# EAGLE schematic merkez (EAGLE 9.6.2)
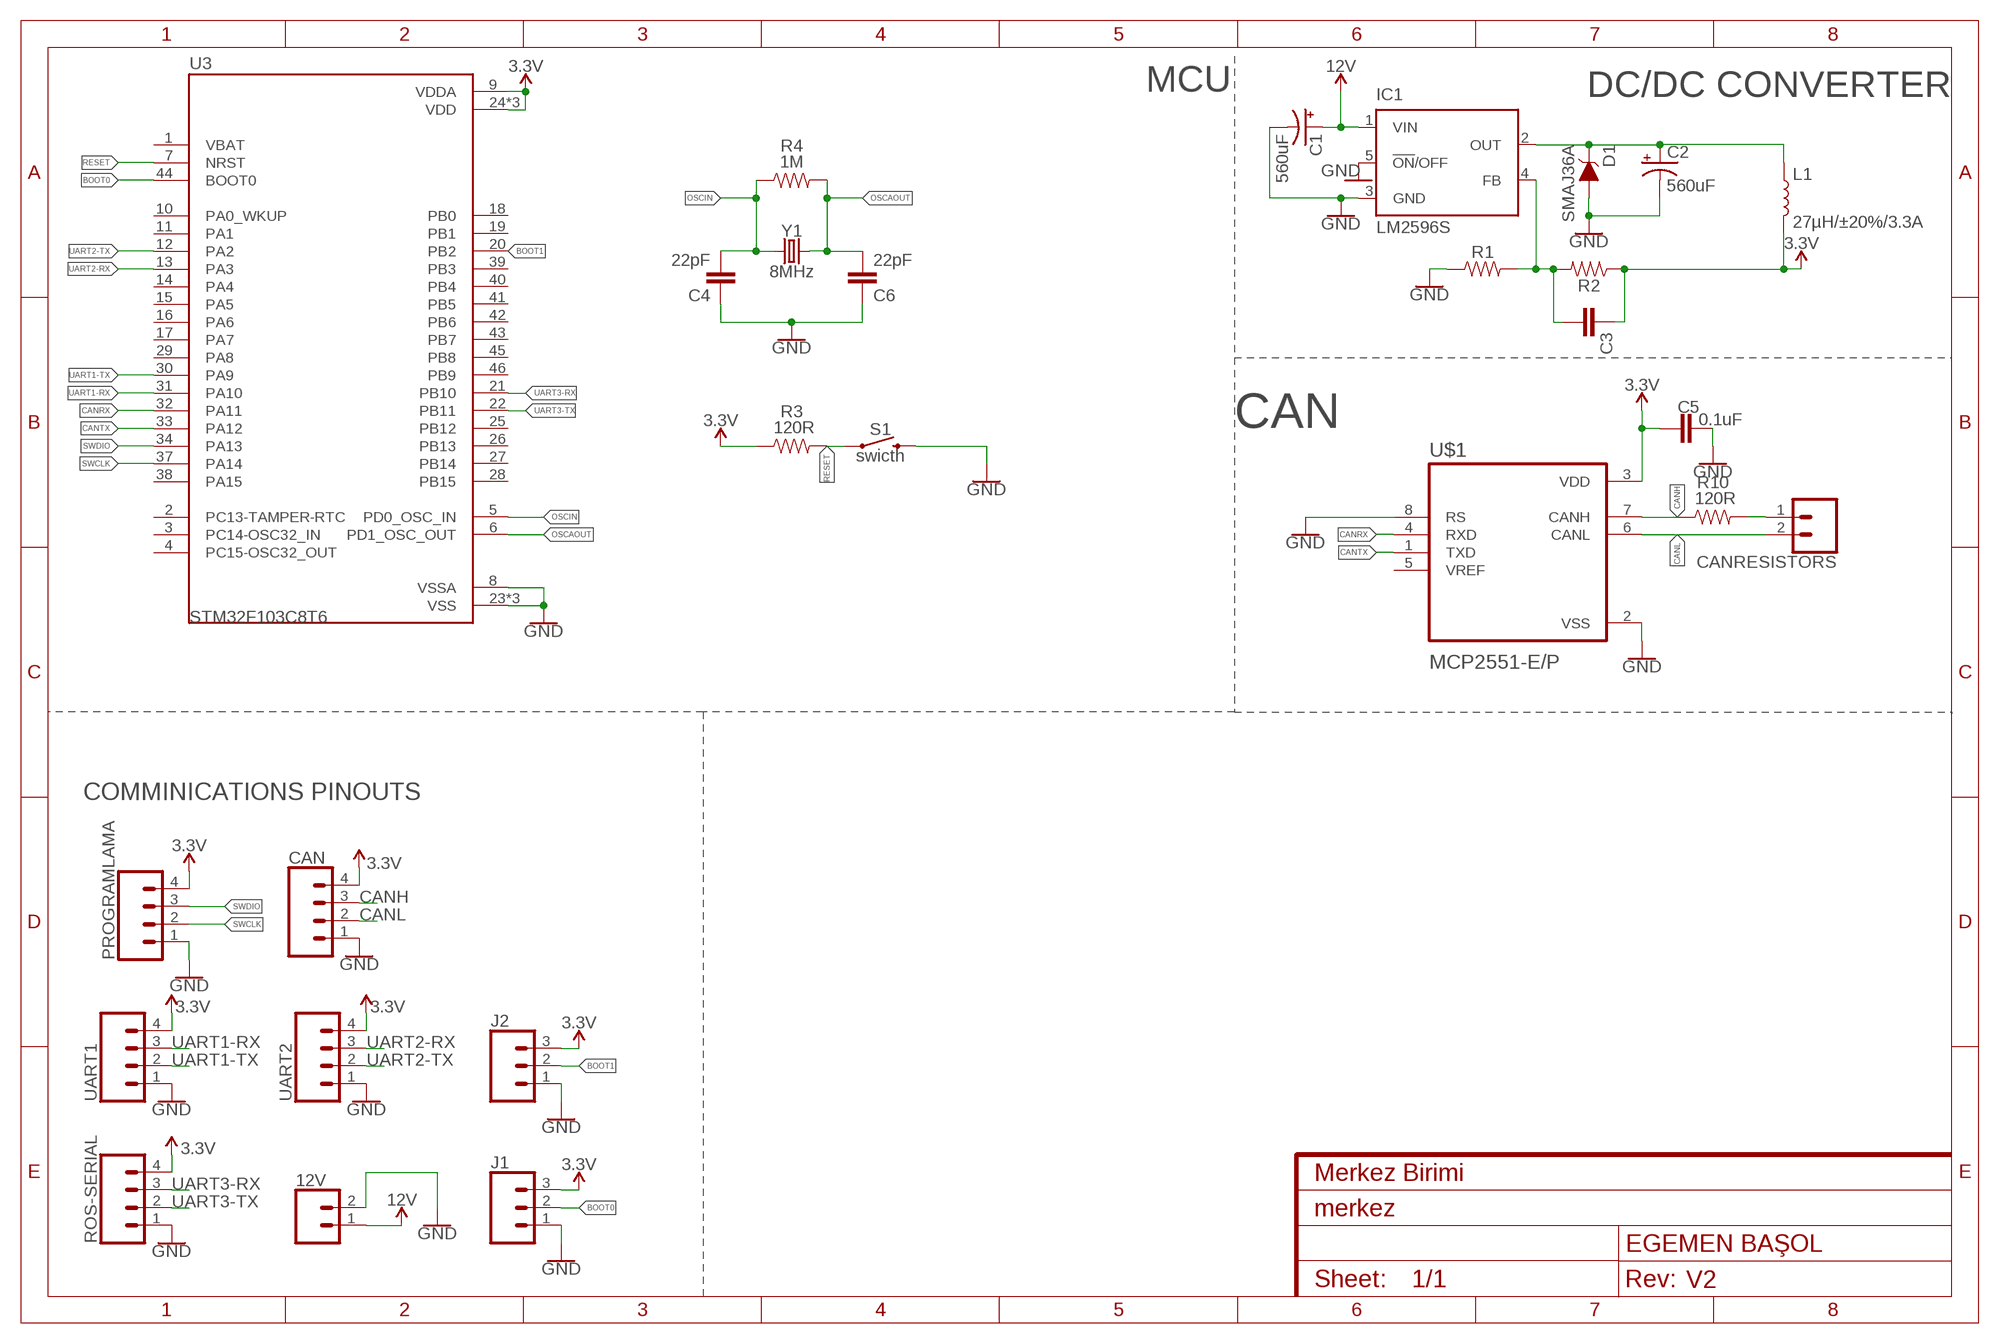
[diagram p0: schematic, sheet 1]
FRAME1 (FRAME-A4L): CNAME: Merkez Birimi; CREVISION: V2; DESIGNER: EGEMEN BAŞOL

## Parts
12V  CONN_023.5MM_LOCK  [SCREWTERMINAL-3.5MM-2_LOCK]
C1  560uF  560UF-PANASONIC_G-25V-20%  [PANASONIC_G]
C2  560uF  560UF-PANASONIC_G-25V-20%  [PANASONIC_G]
C3  CAP-0805  [0805]
C4  22pF  CAP-0805  [0805]
C5  0.1uF  CAP-0805  [0805]
C6  22pF  CAP-0805  [0805]
CAN  CONN_04SCREW_LOCK  [SCREWTERMINAL-3.5MM-4_LOCK]
CANRESISTORS  CONN_02LOCK_LONGPADS  [1X02_LOCK_LONGPADS]
D1  SMAJ36A  DIODE_TVS_UNI  [DO-214AC]
IC1  LM2596S  [TO263-5]
J1  455-1750-1-ND  CONN_03  [1X03]
J2  455-1750-1-ND  CONN_03  [1X03]
L1  27µH/±20%/3.3A  INDUCTOR-SDR13-27UH  [INDUCTOR_SDR1307]
PROGRAMLAMA  CONN_04SCREW_LOCK  [SCREWTERMINAL-3.5MM-4_LOCK]
R1  RESISTOR0805  [0805]
R2  RESISTOR0805  [0805]
R3  120R  RESISTOR0805  [0805]
R4  1M  RESISTOR0805  [0805]
R10  120R  RESISTOR0805  [0805]
ROS-SERIAL  CONN_04SCREW_LOCK  [SCREWTERMINAL-3.5MM-4_LOCK]
S1  swicth  MOMENTARY-SWITCH-SPST-SMD-5.2MM-TALL  [TACTILE_SWITCH_SMD_5.2MM]
U3  STM32F103C8T6  [QFP50P900X900X160-48N]
U$1  MCP2551-E/P  [DIP787W46P254L927H533Q8]
UART1  CONN_04SCREW_LOCK  [SCREWTERMINAL-3.5MM-4_LOCK]
UART2  CONN_04SCREW_LOCK  [SCREWTERMINAL-3.5MM-4_LOCK]
Y1  8MHz  CRYSTAL-8MHZSMD-HC49UP  [HC49UP]

## Nets
3.3V: C3.1 C5.2 CAN.4 J1.3 J2.3 L1.P$2 PROGRAMLAMA.4 R2.1 R3.1 ROS-SERIAL.4 U3.9(VDDA) U3.24(VDD) U3.36(VDD) U3.48(VDD) U$1.3(VDD) UART1.4 UART2.4
12V: 12V.1 C1.+ IC1.1(VIN)
BOOT0: J1.2 U3.44(BOOT0)
BOOT1: J2.2
CANH: CAN.3 R10.1 U$1.7(CANH)
CANL: CAN.2 CANRESISTORS.2 U$1.6(CANL)
CANRX: U3.32(PA11) U$1.4(RXD)
CANTX: U3.33(PA12) U$1.1(TXD)
GND: 12V.2 C1.- C2.- C4.1 C5.1 C6.1 CAN.1 D1.A IC1.3(GND) IC1.5(!ON!/OFF) J1.1 J2.1 PROGRAMLAMA.1 R1.1 ROS-SERIAL.1 S1.3 U3.8(VSSA) U3.23(VSS) U3.35(VSS) U3.47(VSS) U$1.2(VSS) U$1.8(RS) UART1.1 UART2.1
N$1: C2.+ D1.C IC1.2(OUT) L1.P$1
N$2: C3.2 IC1.4(FB) R1.2 R2.2
N$5: CANRESISTORS.1 R10.2
OSCAOUT: C6.2 R4.2 U3.6(PD1_OSC_OUT) Y1.2
OSCIN: C4.2 R4.1 U3.5(PD0_OSC_IN) Y1.1
RESET: R3.2 S1.1 U3.7(NRST)
SWCLK: PROGRAMLAMA.2 U3.37(PA14)
SWDIO: PROGRAMLAMA.3 U3.34(PA13)
UART1-RX: U3.31(PA10) UART1.3
UART1-TX: U3.30(PA9) UART1.2
UART2-RX: U3.13(PA3) UART2.3
UART2-TX: U3.12(PA2) UART2.2
UART3-RX: ROS-SERIAL.3 U3.21(PB10)
UART3-TX: ROS-SERIAL.2 U3.22(PB11)
Unconnected: U3.1(VBAT) U3.2(PC13-TAMPER-RTC) U3.3(PC14-OSC32_IN) U3.4(PC15-OSC32_OUT) U3.10(PA0_WKUP) U3.11(PA1) U3.14(PA4) U3.15(PA5) U3.16(PA6) U3.17(PA7) U3.18(PB0) U3.19(PB1) U3.20(PB2) U3.25(PB12) U3.26(PB13) U3.27(PB14) U3.28(PB15) U3.29(PA8) U3.38(PA15) U3.39(PB3) U3.40(PB4) U3.41(PB5) U3.42(PB6) U3.43(PB7) U3.45(PB8) U3.46(PB9) U$1.5(VREF)

## Notes on the sheet
- MCU | DC/DC CONVERTER
- CAN
- COMMINICATIONS PINOUTS

## Library data of the parts
12V = SparkFun-Connectors:CONN_02: Multi connection point. Often used as Generic Header-pin footprint for 0.1 inch spaced/style header connections On any of the 0.1 inch spaced packages, you can populate with these: Break Away Headers - Straight <https://www.sparkfun.com/products/116> (PRT-00116) Break Away Male Headers - Right Angle <https://www.sparkfun.com/products/553> (PRT-00553) Female Headers <https://www.sparkfun.com/products/115> (PRT-00115) Break Away Headers - Machine Pin <https://www.sparkfun.com/products/117> (PRT-00117) Break Away Female Headers - Swiss Machine Pin <https://www.sparkfun.com/products/743> (PRT-00743) For SCREWTERMINALS and SPRING TERMINALS visit here: Screw Terimnals on SparkFun.com <https://www.sparkfun.com/search/results?term=Screw+Terminals> (5mm/3.5mm/2.54mm spacing) This device is also useful as a general connection point to wire up your design to another part of your project. Our various solder wires solder well into these plated through hole pads. Hook-Up Wire - Assortment (Stranded, 22 AWG) <https://www.sparkfun.com/products/11375> (PRT-11375) Hook-Up Wire - Assortment (Solid Core, 22 AWG) <https://www.sparkfun.com/products/11367> (PRT-11367) View the entire wire category on our website here <https://www.sparkfun.com/categories/141> Special notes: Molex polarized connector foot print use with: PRT-08233 with associated crimp pins and housings. 2.54_SCREWTERM for use with PRT-10571. 3.5mm Screw Terminal footprints for PRT-08084 5mm Screw Terminal footprints for use with PRT-08432; PROD_ID: CONN-08399
C1 C2 = SparkFun-Capacitors:560UF: 560µF polarized capacitors A capacitor is a passive two-terminal electrical component used to store electrical energy temporarily in an electric field.; PROD_ID: CAP-09983
C3-C6 = SparkFun-Capacitors:CAP
CAN PROGRAMLAMA ROS-SERIAL UART1 UART2 = SparkFun-Connectors:CONN_04: Multi connection point. Often used as Generic Header-pin footprint for 0.1 inch spaced/style header connections On any of the 0.1 inch spaced packages, you can populate with these: Break Away Headers - Straight <https://www.sparkfun.com/products/116> (PRT-00116) Break Away Male Headers - Right Angle <https://www.sparkfun.com/products/553> (PRT-00553) Female Headers <https://www.sparkfun.com/products/115> (PRT-00115) Break Away Headers - Machine Pin <https://www.sparkfun.com/products/117> (PRT-00117) Break Away Female Headers - Swiss Machine Pin <https://www.sparkfun.com/products/743> (PRT-00743) For SCREWTERMINALS and SPRING TERMINALS visit here: Screw Terimnals on SparkFun.com <https://www.sparkfun.com/search/results?term=Screw+Terminals> (5mm/3.5mm/2.54mm spacing) This device is also useful as a general connection point to wire up your design to another part of your project. Our various solder wires solder well into these plated through hole pads. Hook-Up Wire - Assortment (Stranded, 22 AWG) <https://www.sparkfun.com/products/11375> (PRT-11375) Hook-Up Wire - Assortment (Solid Core, 22 AWG) <https://www.sparkfun.com/products/11367> (PRT-11367) View the entire wire category on our website here <https://www.sparkfun.com/categories/141> Special notes: Molex polarized connector foot print use with SKU : PRT-08231 with associated crimp pins and housings. 1MM SMD Version SKU: PRT-10208
CANRESISTORS = SparkFun-Connectors:CONN_02: Multi connection point. Often used as Generic Header-pin footprint for 0.1 inch spaced/style header connections On any of the 0.1 inch spaced packages, you can populate with these: Break Away Headers - Straight <https://www.sparkfun.com/products/116> (PRT-00116) Break Away Male Headers - Right Angle <https://www.sparkfun.com/products/553> (PRT-00553) Female Headers <https://www.sparkfun.com/products/115> (PRT-00115) Break Away Headers - Machine Pin <https://www.sparkfun.com/products/117> (PRT-00117) Break Away Female Headers - Swiss Machine Pin <https://www.sparkfun.com/products/743> (PRT-00743) For SCREWTERMINALS and SPRING TERMINALS visit here: Screw Terimnals on SparkFun.com <https://www.sparkfun.com/search/results?term=Screw+Terminals> (5mm/3.5mm/2.54mm spacing) This device is also useful as a general connection point to wire up your design to another part of your project. Our various solder wires solder well into these plated through hole pads. Hook-Up Wire - Assortment (Stranded, 22 AWG) <https://www.sparkfun.com/products/11375> (PRT-11375) Hook-Up Wire - Assortment (Solid Core, 22 AWG) <https://www.sparkfun.com/products/11367> (PRT-11367) View the entire wire category on our website here <https://www.sparkfun.com/categories/141> Special notes: Molex polarized connector foot print use with: PRT-08233 with associated crimp pins and housings. 2.54_SCREWTERM for use with PRT-10571. 3.5mm Screw Terminal footprints for PRT-08084 5mm Screw Terminal footprints for use with PRT-08432
D1 = SparkFun-DiscreteSemi:DIODE_TVS_UNI; PROD_ID: DIO-15812
IC1 = national-semiconductor:LM2596: SIMPLE SWITCHER® Power Converter 150 kHz 3A Step-Down Voltage Regulator Source: http://www.national.com/ds/LM/LM2596.pdf; MF: NATIONAL SEMICONDUCTOR; MPN: LM2596S-ADJ/NOPB; OC_FARNELL: 9494367; OC_NEWARK: 41K3842
J1 J2 = SparkFun-Connectors:CONN_03: Multi connection point. Often used as Generic Header-pin footprint for 0.1 inch spaced/style header connections On any of the 0.1 inch spaced packages, you can populate with these: Break Away Headers - Straight <https://www.sparkfun.com/products/116> (PRT-00116) Break Away Male Headers - Right Angle <https://www.sparkfun.com/products/553> (PRT-00553) Female Headers <https://www.sparkfun.com/products/115> (PRT-00115) Break Away Headers - Machine Pin <https://www.sparkfun.com/products/117> (PRT-00117) Break Away Female Headers - Swiss Machine Pin <https://www.sparkfun.com/products/743> (PRT-00743) Stackable Header - 3 Pin (Female, 0.1") <https://www.sparkfun.com/products/13875> (PRT-13875) For SCREWTERMINALS and SPRING TERMINALS visit here: Screw Terimnals on SparkFun.com <https://www.sparkfun.com/search/results?term=Screw+Terminals> (5mm/3.5mm/2.54mm spacing) This device is also useful as a general connection point to wire up your design to another part of your project. Our various solder wires solder well into these plated through hole pads. Hook-Up Wire - Assortment (Stranded, 22 AWG) <https://www.sparkfun.com/products/11375> (PRT-11375) Hook-Up Wire - Assortment (Solid Core, 22 AWG) <https://www.sparkfun.com/products/11367> (PRT-11367) View the entire wire category on our website here <https://www.sparkfun.com/categories/141> Special notes: Molex polarized connector foot print use with SKU : PRT-08232 with associated crimp pins and housings.; PROD_ID: XXX-00000
L1 = SparkFun-Coils:INDUCTOR: Inductors Resist changes in electrical current. Basically a coil of wire. SparkFun Products: SparkFun Load Cell Amplifier - HX711 <https://www.sparkfun.com/products/13879> IOIO-OTG - V2.2 <https://www.sparkfun.com/products/13613>; PROD_ID: NDUC-12529
R1-R4 R10 = SparkFun-Resistors:RESISTOR: Generic Resistor Package
S1 = SparkFun-Switches:MOMENTARY-SWITCH-SPST: Momentary Switch (Pushbutton) - SPST Normally-open (NO) SPST momentary switches (buttons, pushbuttons). Variants PTH-12MM - 12mm square, through-hole Momentary Pushbutton Switch - 12mm Square <https://www.sparkfun.com/products/9190> (COM-09190) PTH-6.0MM, PTH-6.0MM-KIT - 6.0mm square, through-hole Mini Pushbutton Switch <https://www.sparkfun.com/products/97> (COM-00097) KIT package intended for soldering kit's - only one side of pads' copper is exposed. PTH-RIGHT-ANGLE-KIT - Right-angle, through-hole Right Angle Tactile Button <https://www.sparkfun.com/products/10791> - Used on SparkFun BigTime Watch Kit <https://www.sparkfun.com/products/11734> SMD-12MM - 12mm square, surface-mount Tactile Button - SMD (12mm) <https://www.sparkfun.com/products/12993> (COM-12993) Used on SparkFun PicoBoard <https://www.sparkfun.com/products/11888> SMD-4.5MM - 4.5mm Square Trackball Switch Used on SparkFun Blackberry Trackballer Breakout <https://www.sparkfun.com/products/13169> SMD-4.6MMX2.8MM - 4.60mm x 2.80mm, surface mount Used on SparkFun Pro Micro - RP2040 <https://www.sparkfun.com/products/17717> SMD-5.2MM, SMD-5.2-REDUNDANT - 5.2mm square, surface-mount Mini Pushbutton Switch - SMD <https://www.sparkfun.com/products/8720> (COM-08720) Used on Arduino Pro Mini <https://www.sparkfun.com/products/11114> REDUNDANT package connects both switch circuits together SMD-6.0X3.5MM - 6.0 x 3.5mm, surface mount Momentary Reset Switch SMD <https://www.sparkfun.com/products/8229> (COM-08229) SMD-6.2MM-TALL - 6.2mm square, surface mount Tactile Button - SMD (6mm) <https://www.sparkfun.com/products/12992> Used on SparkFun Digital Sandbox <https://www.sparkfun.com/products/12651> SMD-RIGHT-ANGLE - Right-angle, surface mount Used on SparkFun Block for Intel® Edison - Arduino <https://www.sparkfun.com/products/13036>; PROD_ID: SWCH-14139
U3 = STM32F103C8T6:STM32F103C8T6: Mainstream Performance line, ARM Cortex-M3 MCU with 64 Kbytes Flash, 72 MHz CPU, motor control, USB and CAN Check availability <https://pricing.snapeda.com/parts/STM32F103C8T6/STMicroelectronics/view-part?ref=eda>; AVAILABILITY: In Stock; DESCRIPTION: ARM® Cortex®-M3 STM32F1 Microcontroller IC 32-Bit 72MHz 64KB (64K x 8) FLASH 48-LQFP (7x7); MF: STMicroelectronics; MP: STM32F103C8T6; PACKAGE: LQFP-48 STMicroelectronics; PRICE: None; PURCHASE-URL: https://pricing.snapeda.com/search/part/STM32F103C8T6/?ref=eda
U$1 = MCP2551-E_P:MCP2551-E/P: Check availability <https://pricing.snapeda.com/parts/MCP2551-E/P/Microchip/view-part?ref=eda>; AVAILABILITY: In Stock; DESCRIPTION: 1/1 Transceiver Half CANbus 8-PDIP; MF: Microchip; MP: MCP2551-E/P; PACKAGE: DIP-8 Microchip; PRICE: None; PURCHASE-URL: https://pricing.snapeda.com/search/part/MCP2551-E/P/?ref=eda
Y1 = SparkFun-Clocks:CRYSTAL-8MHZ: 8MHz Crystal Datasheet Example <http://www.futureelectronics.com/en/technologies/electromechanical/timing-devices/crystals/Pages/6008189-ABM3B-8.000MHZ-B2-T.aspx?IM=0> Frequency: 8MHz Frequency Tolerance: ±20ppm Load Capacitance: 18pF SparkFun Products: Pro Micro -3.3V/8MHz <https://www.sparkfun.com/products/12587> WAV Trigger <https://www.sparkfun.com/products/13660>; PROD_ID: XTAL-11706